# EasyEDA schematic SCH_Just-random_2026-04-02 (2).json
TITLE: Sheet_1; REV: 1.0; Date: 2026-04-02; Sheet: 1/1; Drawn By: camhen2749; Company: Your Company
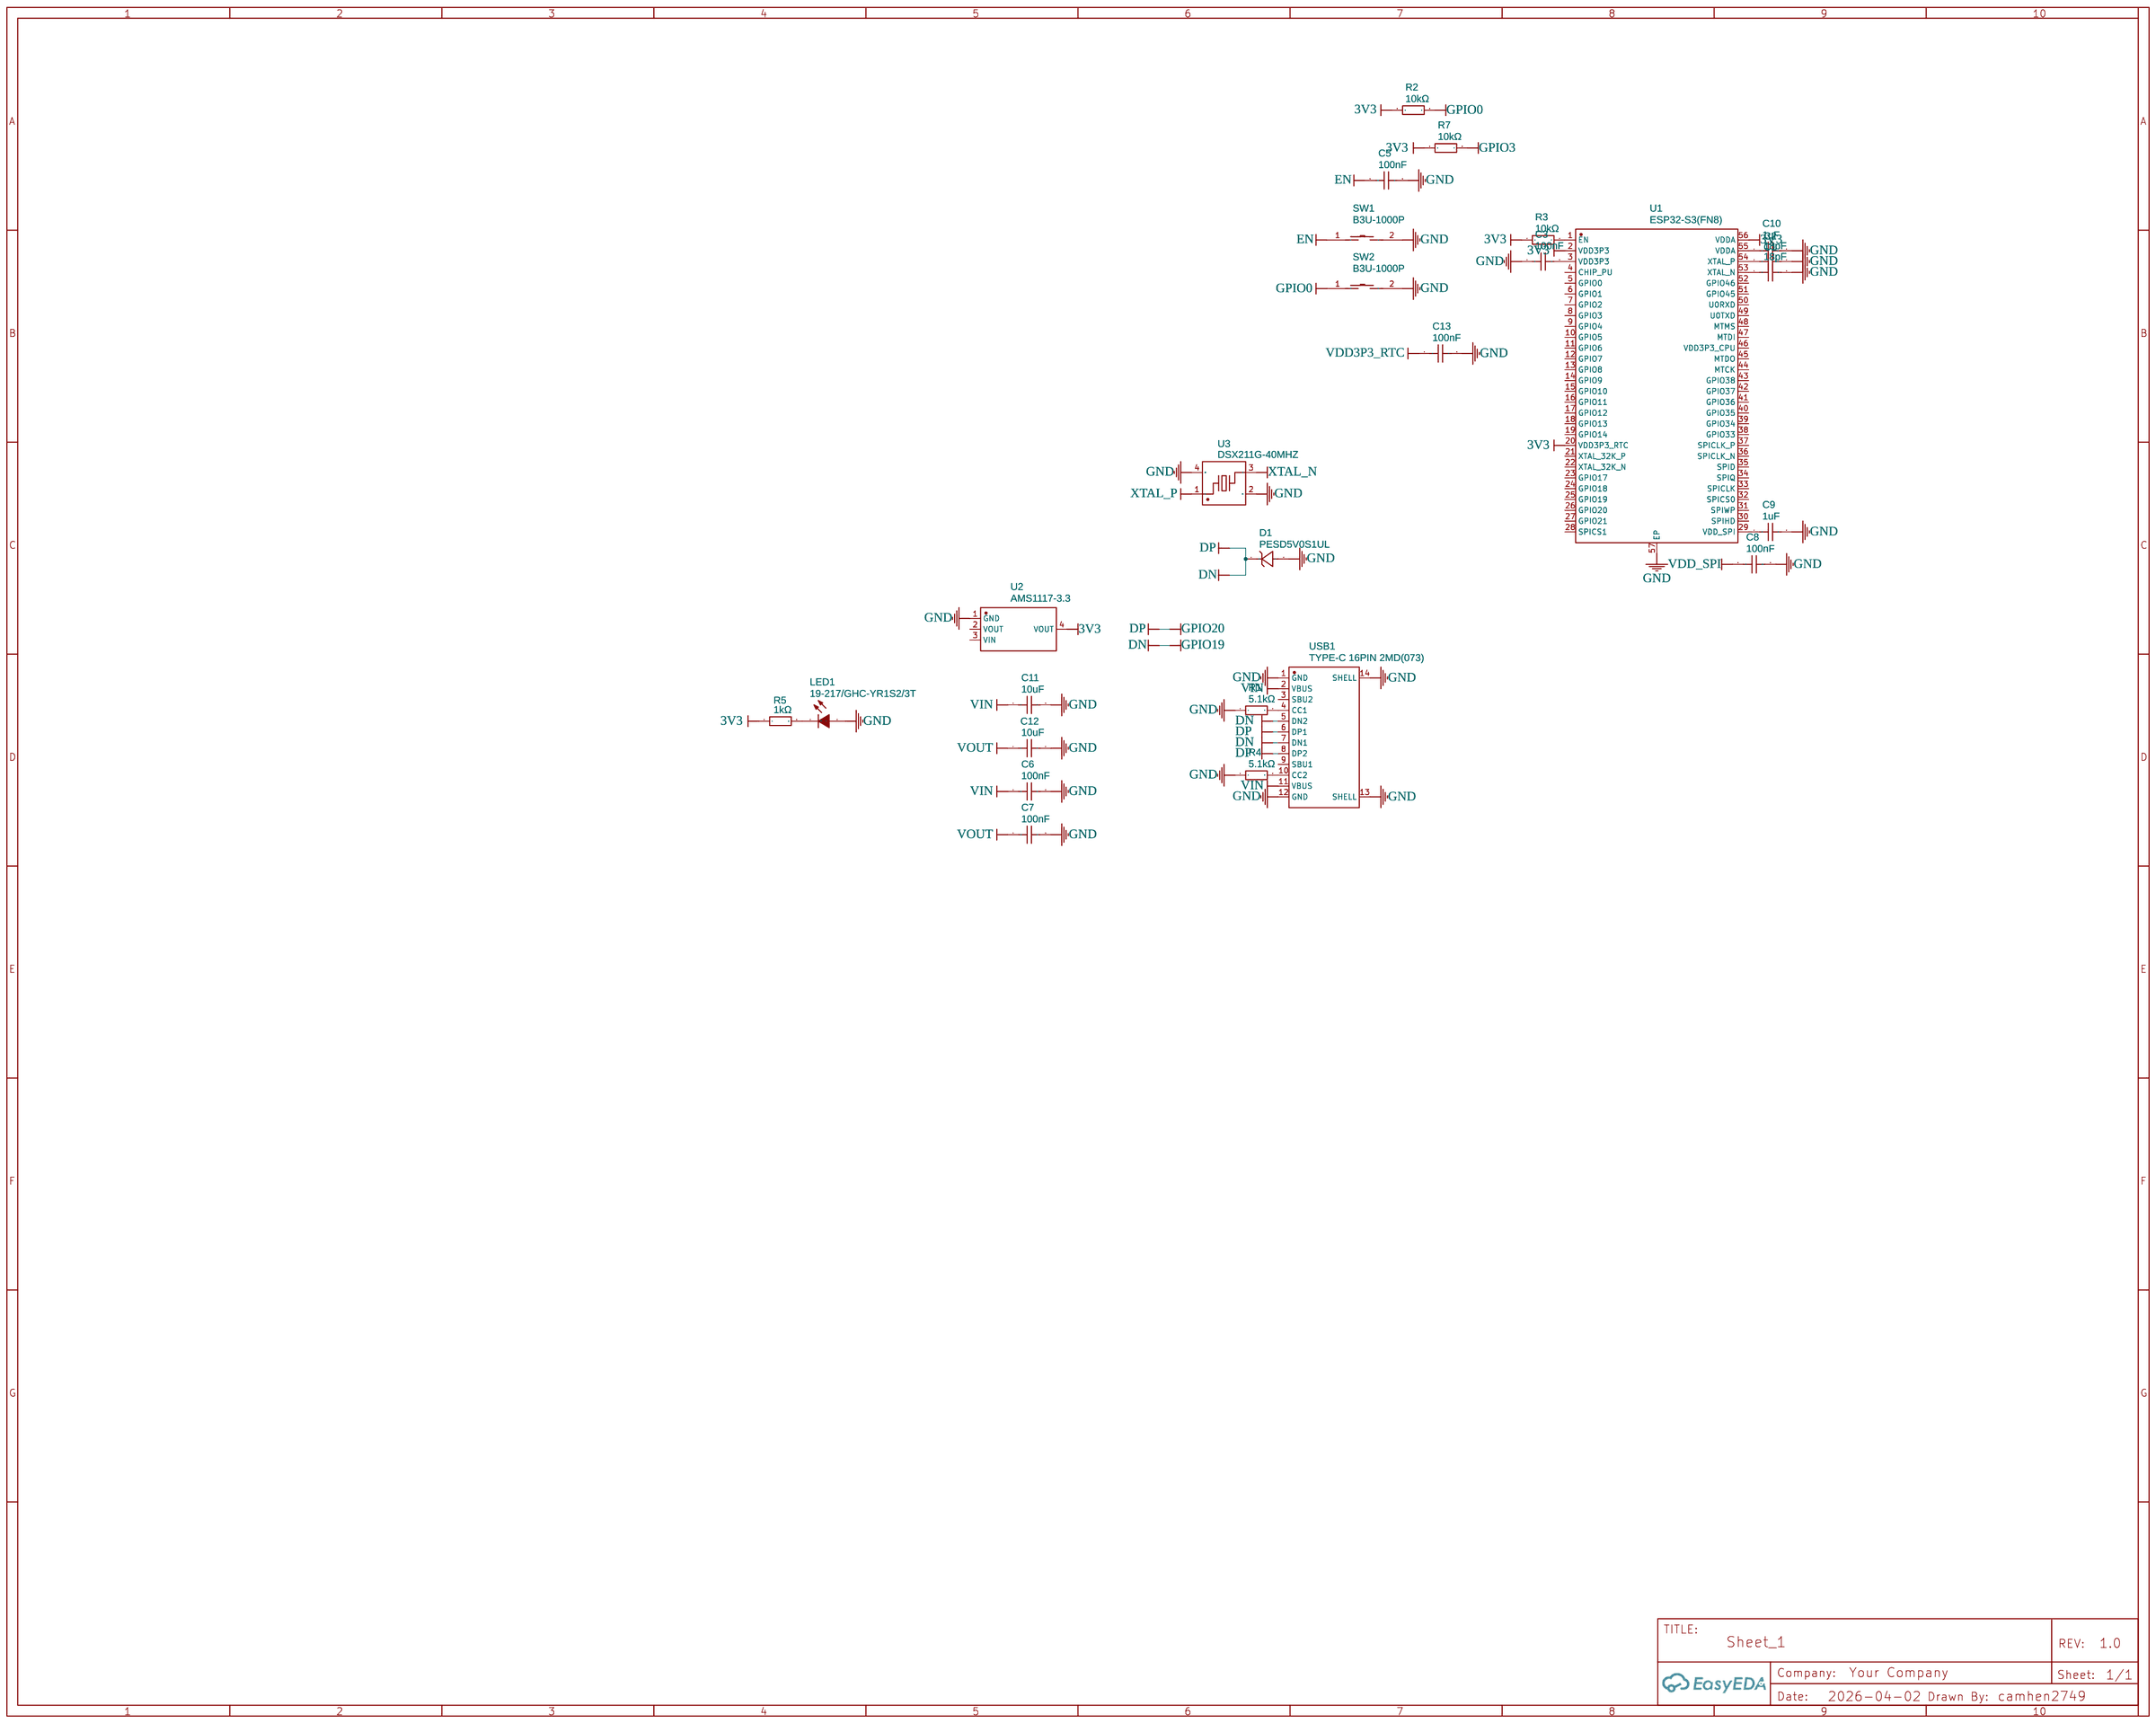
[diagram p0: schematic sheet]

## Parts
C1  18pF  [C0402]
C2  18pF  [C0402]
C3  100nF  [C0402]
C5  100nF  [C0402]
C6  100nF  [C0402]
C7  100nF  [C0402]
C8  100nF  [C0402]
C9  1uF  [C0402]
C10  1uF  [C0402]
C11  10uF  [C0805]
C12  10uF  [C0805]
C13  100nF  [C0402]
D1  PESD5V0S1UL  [X1-DFN1006-2_L1.0-W0.6-RD]
LED1  19-217/GHC-YR1S2/3T  [LED0603-RD]
R1  5.1kΩ  [R0402]
R2  10kΩ  [R0402]
R3  10kΩ  [R0402]
R4  5.1kΩ  [R0402]
R5  1kΩ  [R0402]
R7  10kΩ  [R0402]
SW1  B3U-1000P  [KEY-SMD_B3U-1000PM]
SW2  B3U-1000P  [KEY-SMD_B3U-1000PM]
U1  ESP32-S3(FN8)  [QFN-56_L7.0-W7.0-P0.40-TL-EP4.0]
U2  AMS1117-3.3  [SOT-223-3_L6.5-W3.4-P2.30-LS7.0-BR]
U3  DSX211G-40MHZ  [CRYSTAL-SMD_4P-L2.0-W1.6-BL]
USB1  TYPE-C 16PIN 2MD(073)  [USB-C-SMD_TYPE-C-6PIN-2MD-073]

## Library data of the parts
C1 C2 = CL05C180JB5NNNC: Contributor: LCSC; Supplier: LCSC; Supplier Part: C307443; Manufacturer: SAMSUNG(三星); JLCPCB Part Class: Extended Part
C3 C5-C8 C13 = CL05B104KO5NNNC: Supplier: LCSC; Manufacturer: SAMSUNG(三星); Supplier Part: C1525; JLCPCB Part Class: Basic Part
C9 C10 = CL05A105KA5NQNC: Supplier: LCSC; Manufacturer: SAMSUNG(三星); Supplier Part: C52923; JLCPCB Part Class: Basic Part
C11 C12 = CL21A106KAYNNNE: Supplier: LCSC; Manufacturer: SAMSUNG(三星); Supplier Part: C15850; JLCPCB Part Class: Basic Part
D1 = PESD5V0S1UL: Supplier: LCSC; Supplier Part: C46472763; Manufacturer: TECH PUBLIC(台舟); Contributor: lcsc
LED1 = 19-217/GHC-YR1S2/3T: Supplier: LCSC; Manufacturer: EVERLIGHT(亿光); Supplier Part: C72043; JLCPCB Part Class: Extended Part
R1 R4 = RC0402FR-075K1L: Supplier: LCSC; Manufacturer: YAGEO(国巨); Supplier Part: C105872; JLCPCB Part Class: Extended Part
R2 R3 R7 = RC0402FR-0710KL: Supplier: LCSC; Manufacturer: YAGEO(国巨); Supplier Part: C60490; JLCPCB Part Class: Extended Part
R5 = RC0402FR-071KL: Supplier: LCSC; Manufacturer: YAGEO(国巨); Supplier Part: C106235; JLCPCB Part Class: Extended Part
SW1 SW2 = B3U-1000P: Contributor: LCSC; Supplier: LCSC; Supplier Part: C231329; Manufacturer: OMRON(欧姆龙); JLCPCB Part Class: Extended Part
U1 = ESP32-S3(FN8): Contributor: LCSC; Supplier: LCSC; Supplier Part: C2913196; Manufacturer: ESPRESSIF(乐鑫); Manufacturer Part: ESP32-S3FN8; JLCPCB Part Class: Extended Part
U2 = AMS1117-3.3: sourceId: dwIGgezVh; Supplier: LCSC; Manufacturer: AMS; Supplier Part: C6186; JLCPCB Part Class: Basic Part
U3 = DSX211G-40MHZ: Supplier: LCSC; Supplier Part: C9900201033; Manufacturer: null; Manufacturer Part: DSX211G-40MHz; JLCPCB Part Class: Extended Part; Contributor: lcsc
USB1 = TYPE-C 16PIN 2MD(073): Contributor: LCSC; Supplier: LCSC; Supplier Part: C2765186; Manufacturer: SHOU HAN(首韩); JLCPCB Part Class: Extended Part

## Nets
3V3: R2.1 R3.1 R5.1 R7.1 U1.2(VDD3P3) U1.20(VDD3P3_RTC) U1.56(VDDA) U2.4(VOUT)
GND: C1.2 C2.1 C3.1 C5.2 C6.2 C7.2 C8.2 C9.2 C10.2 C11.2 C12.2 C13.2 D1.2(A) LED1.2(A) R1.1 R4.1 SW1.2 SW2.2 U1.57(EP) U2.1(GND) U3.2(GND/NC) U3.4(GND/NC) USB1.1(GND) USB1.12(GND) USB1.13(SHELL) USB1.14(SHELL)
VDD3P3_RTC: C13.1
VDD_SPI: C8.1
VIN: C6.1 C11.1 USB1.2(VBUS) USB1.11(VBUS)
DN: D1.1(C) USB1.5(DN2) USB1.6(DP1) USB1.7(DN1) USB1.8(DP2)
EN: C5.1 SW1.1
GPIO0: R2.2 SW2.1
GPIO3: R7.2
VOUT: C7.1 C12.1
XTAL_N: U3.3
XTAL_P: U3.1
Net-(C1-1): C1.1 U1.53(XTAL_N)
Net-(C2-2): C2.2 U1.54(XTAL_P)
Net-(C3-2): C3.2 U1.3(VDD3P3)
Net-(C9-1): C9.1 U1.29(VDD_SPI)
Net-(C10-1): C10.1 U1.55(VDDA)
Net-(LED1-1): LED1.1(C) R5.2
Net-(R1-2): R1.2 USB1.4(CC1)
Net-(R3-2): R3.2 U1.1(EN)
Net-(R4-2): R4.2 USB1.10(CC2)

Not connected (* = marked no-connect by the designer): U1 4(CHIP_PU) 5(GPIO0) 6(GPIO1) 7(GPIO2) 8(GPIO3) 9(GPIO4) 10(GPIO5) 11(GPIO6) 12(GPIO7) 13(GPIO8) 14(GPIO9) 15(GPIO10) 16(GPIO11) 17(GPIO12) 18(GPIO13) 19(GPIO14) 21(XTAL_32K_P) 22(XTAL_32K_N) 23(GPIO17) 24(GPIO18) 25(GPIO19) 26(GPIO20) 27(GPIO21) 28(SPICS1) 30(SPIHD) 31(SPIWP) 32(SPICS0) 33(SPICLK) 34(SPIQ) 35(SPID) 36(SPICLK_N) 37(SPICLK_P) 38(GPIO33) 39(GPIO34) 40(GPIO35) 41(GPIO36) 42(GPIO37) 43(GPIO38) 44(MTCK) 45(MTDO) 46(VDD3P3_CPU) 47(MTDI) 48(MTMS) 49(U0TXD) 50(U0RXD) 51(GPIO45) 52(GPIO46); U2 2(VOUT) 3(VIN); USB1 3(SBU2) 9(SBU1)
